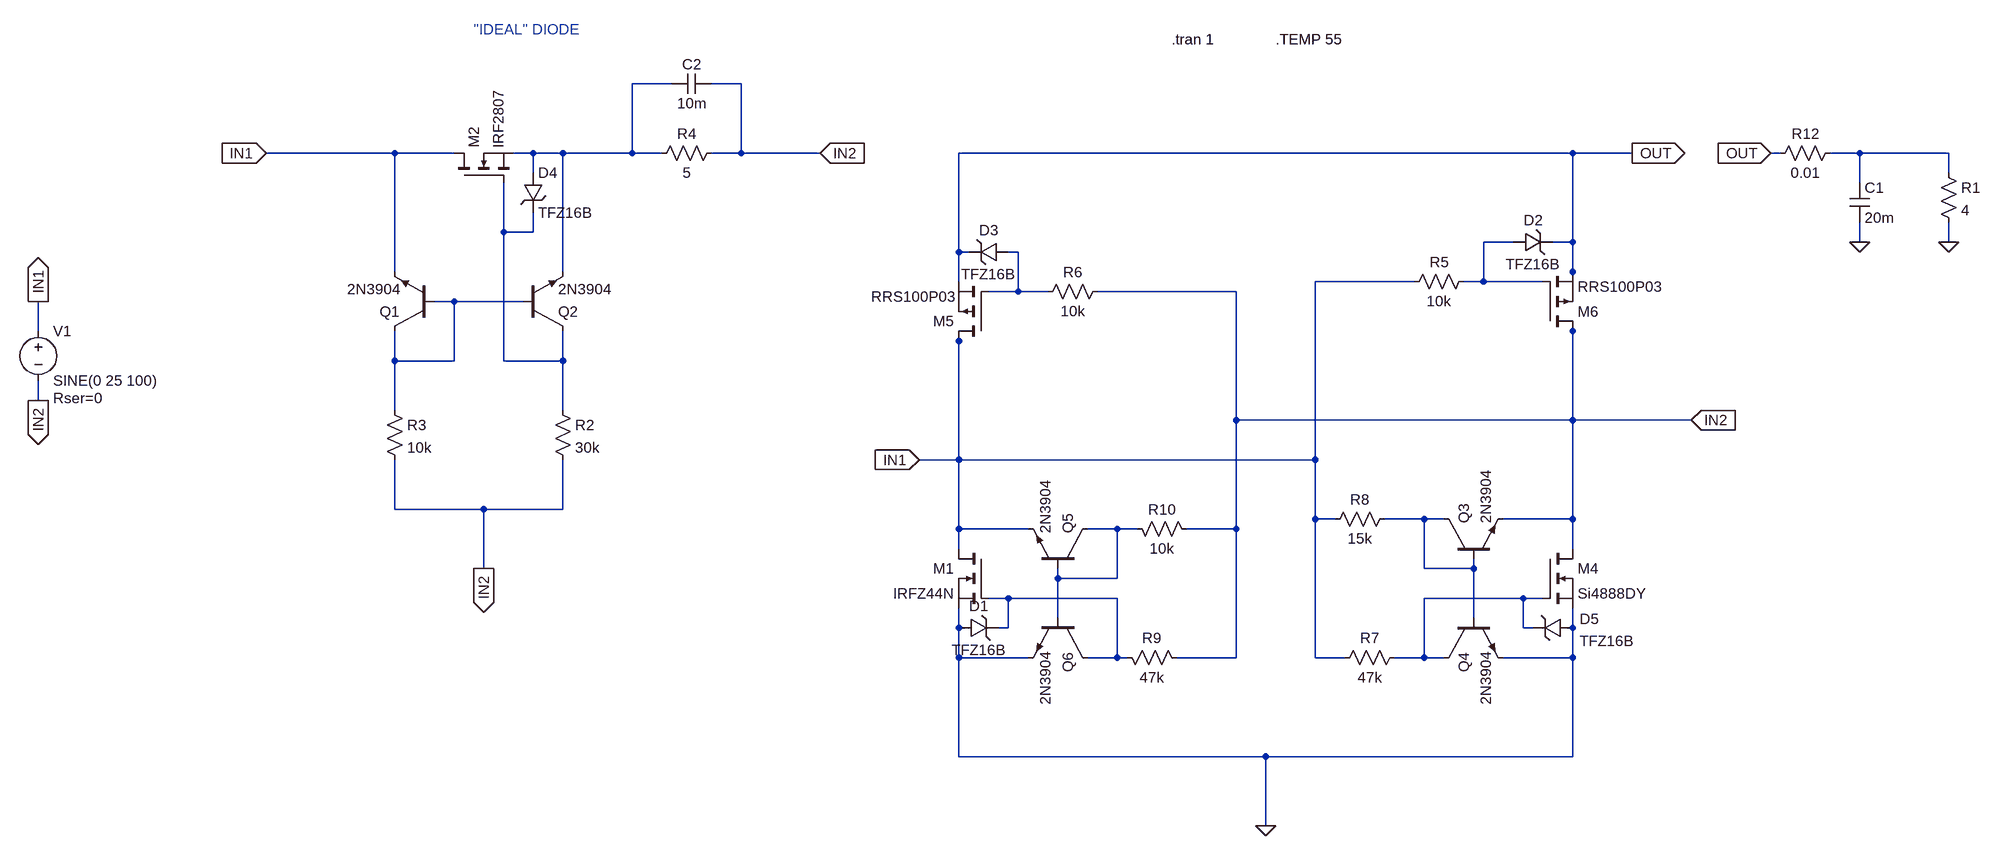
[diagram p0: schematic bridge_fet.asc]
bridge_fet.asc, the LTspice schematic file:
Version 4
SHEET 1 2348 1332
WIRE -384 -176 -448 -176
WIRE -272 -176 -320 -176
WIRE -832 -64 -1040 -64
WIRE -736 -64 -832 -64
WIRE -608 -64 -640 -64
WIRE -560 -64 -608 -64
WIRE -448 -64 -448 -176
WIRE -448 -64 -560 -64
WIRE -400 -64 -448 -64
WIRE -272 -64 -272 -176
WIRE -272 -64 -320 -64
WIRE -144 -64 -272 -64
WIRE 1072 -64 80 -64
WIRE 1168 -64 1072 -64
WIRE 1408 -64 1392 -64
WIRE 1536 -64 1488 -64
WIRE 1680 -64 1536 -64
WIRE -608 -32 -608 -64
WIRE 1680 -32 1680 -64
WIRE 1536 -16 1536 -64
WIRE -656 64 -656 -16
WIRE -608 64 -608 32
WIRE -608 64 -656 64
WIRE 976 80 928 80
WIRE 1072 80 1072 -64
WIRE 1072 80 1040 80
WIRE 1536 80 1536 48
WIRE 1680 80 1680 48
WIRE 80 96 80 -64
WIRE 96 96 80 96
WIRE 176 96 160 96
WIRE -832 128 -832 -64
WIRE -560 128 -560 -64
WIRE 1072 128 1072 80
WIRE 80 144 80 96
WIRE 816 144 656 144
WIRE 928 144 928 80
WIRE 928 144 896 144
WIRE 1024 144 928 144
WIRE 1072 144 1072 128
WIRE 176 160 176 96
WIRE 176 160 128 160
WIRE 224 160 176 160
WIRE 528 160 304 160
WIRE -736 176 -768 176
WIRE -624 176 -736 176
WIRE -1408 224 -1408 176
WIRE 1072 224 1072 208
WIRE 80 240 80 224
WIRE -832 272 -832 224
WIRE -736 272 -736 176
WIRE -736 272 -832 272
WIRE -656 272 -656 64
WIRE -560 272 -560 224
WIRE -560 272 -656 272
WIRE 656 320 656 144
WIRE -1408 336 -1408 304
WIRE -832 352 -832 272
WIRE -560 352 -560 272
WIRE 528 368 528 160
WIRE 1072 368 1072 224
WIRE 1072 368 528 368
WIRE 1264 368 1072 368
WIRE 80 432 80 240
WIRE 80 432 16 432
WIRE 656 432 656 320
WIRE 656 432 80 432
WIRE -832 512 -832 432
WIRE -688 512 -832 512
WIRE -560 512 -560 432
WIRE -560 512 -688 512
WIRE 656 528 656 432
WIRE 688 528 656 528
WIRE 832 528 768 528
WIRE 864 528 832 528
WIRE 1072 528 1072 368
WIRE 1072 528 960 528
WIRE 80 544 80 432
WIRE 192 544 80 544
WIRE 336 544 288 544
WIRE 368 544 336 544
WIRE 528 544 528 368
WIRE 528 544 448 544
WIRE 80 576 80 544
WIRE 1072 576 1072 528
WIRE -688 608 -688 512
WIRE 832 608 832 528
WIRE 912 608 912 592
WIRE 912 608 832 608
WIRE 240 624 240 608
WIRE 336 624 336 544
WIRE 336 624 240 624
WIRE 160 656 128 656
WIRE 336 656 160 656
WIRE 992 656 832 656
WIRE 1024 656 992 656
WIRE 240 688 240 624
WIRE 912 688 912 608
WIRE 80 704 80 672
WIRE 160 704 160 656
WIRE 160 704 144 704
WIRE 992 704 992 656
WIRE 1008 704 992 704
WIRE 1072 704 1072 672
WIRE 80 752 80 704
WIRE 192 752 80 752
WIRE 336 752 336 656
WIRE 336 752 288 752
WIRE 352 752 336 752
WIRE 528 752 528 544
WIRE 528 752 432 752
WIRE 656 752 656 528
WIRE 704 752 656 752
WIRE 832 752 832 656
WIRE 832 752 784 752
WIRE 864 752 832 752
WIRE 1072 752 1072 704
WIRE 1072 752 960 752
WIRE 80 912 80 752
WIRE 576 912 80 912
WIRE 1072 912 1072 752
WIRE 1072 912 576 912
WIRE 576 1024 576 912
FLAG -1408 176 IN1
IOPIN -1408 176 Out
FLAG 16 432 IN1
IOPIN 16 432 In
FLAG -1408 336 IN2
IOPIN -1408 336 Out
FLAG 1264 368 IN2
IOPIN 1264 368 In
FLAG 576 1024 0
FLAG 1680 80 0
FLAG -1040 -64 IN1
IOPIN -1040 -64 In
FLAG -688 608 IN2
IOPIN -688 608 Out
FLAG -144 -64 IN2
IOPIN -144 -64 In
FLAG 1536 80 0
FLAG 1168 -64 OUT
IOPIN 1168 -64 Out
FLAG 1392 -64 OUT
IOPIN 1392 -64 In
DATAFLAG 656 320 ""
SYMBOL voltage -1408 208 R0
WINDOW 123 0 0 Left 2
WINDOW 39 24 124 Left 2
SYMATTR SpiceLine Rser=0
SYMATTR InstName V1
SYMATTR Value SINE(0 25 100)
SYMBOL res 1664 -48 R0
SYMATTR InstName R1
SYMATTR Value 4
SYMBOL npn -768 224 R180
SYMATTR InstName Q1
SYMATTR Value 2N3904
SYMBOL npn -624 224 M180
SYMATTR InstName Q2
SYMATTR Value 2N3904
SYMBOL res -576 336 R0
SYMATTR InstName R2
SYMATTR Value 30k
SYMBOL res -848 336 R0
SYMATTR InstName R3
SYMATTR Value 10k
SYMBOL nmos -736 -16 R270
SYMATTR InstName M2
SYMATTR Value IRF2807
SYMBOL res -416 -48 R270
WINDOW 0 32 56 VTop 2
WINDOW 3 0 56 VBottom 2
SYMATTR InstName R4
SYMATTR Value 5
SYMBOL zener -624 -32 R0
SYMATTR InstName D4
SYMATTR Value TFZ16B
SYMATTR Description Diode
SYMATTR Type diode
SYMBOL npn 864 592 R270
SYMATTR InstName Q3
SYMATTR Value 2N3904
SYMBOL npn 864 688 M90
SYMATTR InstName Q4
SYMATTR Value 2N3904
SYMBOL res 800 736 R90
WINDOW 0 0 56 VBottom 2
WINDOW 3 32 56 VTop 2
SYMATTR InstName R7
SYMATTR Value 47k
SYMBOL res 784 512 R90
WINDOW 0 0 56 VBottom 2
WINDOW 3 32 56 VTop 2
SYMATTR InstName R8
SYMATTR Value 15k
SYMBOL nmos 1024 576 R0
SYMATTR InstName M4
SYMATTR Value Si4888DY
SYMBOL cap 1520 -16 R0
SYMATTR InstName C1
SYMATTR Value 20m
SYMBOL pmos 128 240 R180
SYMATTR InstName M5
SYMATTR Value RRS100P03
SYMBOL pmos 1024 224 M180
SYMATTR InstName M6
SYMATTR Value RRS100P03
SYMBOL npn 288 608 M270
SYMATTR InstName Q5
SYMATTR Value 2N3904
SYMBOL npn 288 688 R90
SYMATTR InstName Q6
SYMATTR Value 2N3904
SYMBOL res 336 736 M90
WINDOW 0 0 56 VBottom 2
WINDOW 3 32 56 VTop 2
SYMATTR InstName R9
SYMATTR Value 47k
SYMBOL res 352 528 M90
WINDOW 0 0 56 VBottom 2
WINDOW 3 32 56 VTop 2
SYMATTR InstName R10
SYMATTR Value 10k
SYMBOL nmos 128 576 M0
SYMATTR InstName M1
SYMATTR Value IRFZ44N
SYMBOL cap -384 -160 R270
WINDOW 0 32 32 VTop 2
WINDOW 3 0 32 VBottom 2
SYMATTR InstName C2
SYMATTR Value 10m
SYMBOL res 912 128 R90
WINDOW 0 0 56 VBottom 2
WINDOW 3 32 56 VTop 2
SYMATTR InstName R5
SYMATTR Value 10k
SYMBOL res 320 144 R90
WINDOW 0 0 56 VBottom 2
WINDOW 3 32 56 VTop 2
SYMATTR InstName R6
SYMATTR Value 10k
SYMBOL zener 976 96 R270
WINDOW 0 36 32 VTop 2
WINDOW 3 -4 32 VBottom 2
SYMATTR InstName D2
SYMATTR Value TFZ16B
SYMATTR Description Diode
SYMATTR Type diode
SYMBOL zener 160 80 R90
WINDOW 0 -4 32 VBottom 2
WINDOW 3 36 32 VTop 2
SYMATTR InstName D3
SYMATTR Value TFZ16B
SYMATTR Description Diode
SYMATTR Type diode
SYMBOL zener 80 720 R270
WINDOW 0 36 32 VTop 2
WINDOW 3 -4 32 VBottom 2
SYMATTR InstName D1
SYMATTR Value TFZ16B
SYMATTR Description Diode
SYMATTR Type diode
SYMBOL zener 1072 688 R90
WINDOW 0 17 -27 VBottom 2
WINDOW 3 21 -55 VTop 2
SYMATTR InstName D5
SYMATTR Value TFZ16B
SYMATTR Description Diode
SYMATTR Type diode
SYMBOL res 1504 -80 R90
WINDOW 0 0 56 VBottom 2
WINDOW 3 32 56 VTop 2
SYMATTR InstName R12
SYMATTR Value 0.01
TEXT 424 -248 Left 2 !.tran 1
TEXT 592 -248 Left 2 !.TEMP 55
TEXT -704 -264 Left 2 ;"IDEAL" DIODE

The netlist it stands for:
* bridge_fet.asc
V1 IN1 IN2 SINE(0 25 100) Rser=0
R1 N002 0 4
Q1 N006 N006 IN1 0 2N3904
Q2 N003 N006 N001 0 2N3904
R2 N003 IN2 30k
R3 N006 IN2 10k
M2 IN1 N003 N001 N001 IRF2807
R4 N001 IN2 5
D4 N001 N003 TFZ16B
Q3 N007 N007 IN2 0 2N3904
Q4 N010 N007 0 0 2N3904
R7 N010 IN1 47k
R8 N007 IN1 15k
M4 IN2 N010 0 0 Si4888DY
C1 N002 0 20m
M5 IN1 N005 OUT OUT RRS100P03
M6 IN2 N004 OUT OUT RRS100P03
Q5 N008 N008 IN1 0 2N3904
Q6 N009 N008 0 0 2N3904
R9 N009 IN2 47k
R10 N008 IN2 10k
M1 IN1 N009 0 0 IRFZ44N
C2 N001 IN2 10m
R5 N004 IN1 10k
R6 IN2 N005 10k
D2 N004 OUT TFZ16B
D3 N005 OUT TFZ16B
D1 0 N009 TFZ16B
D5 0 N010 TFZ16B
R12 N002 OUT 0.01
.model D D
.lib standard.dio
.model NPN NPN
.model PNP PNP
.lib standard.bjt
.model NMOS NMOS
.model PMOS PMOS
.lib standard.mos
.tran 1
.TEMP 55
* "IDEAL" DIODE
.backanno
.end